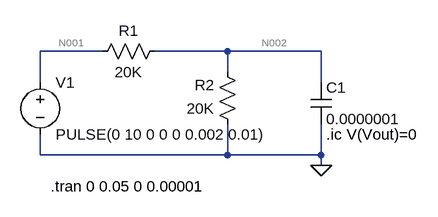
[diagram p0: schematic ELEN 115 Lab 2 Part 2.asc]
ELEN 115 Lab 2 Part 2.asc, the LTspice schematic file:
Version 4
SHEET 1 880 680
WIRE 48 112 -48 112
WIRE 240 112 128 112
WIRE 384 112 240 112
WIRE 240 144 240 112
WIRE -48 160 -48 112
WIRE 384 160 384 112
WIRE -48 272 -48 240
WIRE 240 272 240 224
WIRE 240 272 -48 272
WIRE 384 272 384 224
WIRE 384 272 240 272
WIRE 384 288 384 272
FLAG 384 288 0
SYMBOL res 144 96 R90
WINDOW 0 0 56 VBottom 2
WINDOW 3 32 56 VTop 2
SYMATTR InstName R1
SYMATTR Value 20K
SYMBOL res 256 240 R180
WINDOW 0 36 76 Left 2
WINDOW 3 36 40 Left 2
SYMATTR InstName R2
SYMATTR Value 20K
SYMBOL cap 368 160 R0
SYMATTR InstName C1
SYMATTR Value 0.0000001
SYMBOL voltage -48 144 R0
WINDOW 123 0 0 Left 0
WINDOW 39 0 0 Left 0
SYMATTR InstName V1
SYMATTR Value PULSE(0 10 0 0 0 0.002 0.01)
TEXT 392 240 Left 2 !.ic V(Vout)=0
TEXT -32 320 Left 2 !.tran 0 0.05 0 0.00001

The netlist it stands for:
* ELEN 115 Lab 2 Part 2.asc
R1 N002 N001 20K
R2 0 N002 20K
C1 N002 0 0.0000001
V1 N001 0 PULSE(0 10 0 0 0 0.002 0.01)
.ic V(Vout)=0
.tran 0 0.05 0 0.00001
.backanno
.end

* Results of the author's LTspice run, read from the files saved beside the schematic
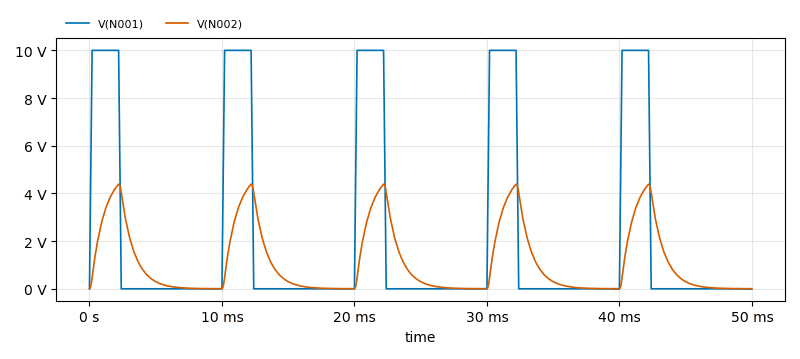
[diagram p1: Transient Analysis of ELEN 115 Lab 2 Part 2.asc, plotted from the saved traces]
* Transient Analysis, 1 run:
*   V(N001): min 0 V, max 10 V, average 2.2 V, rms 4.621 V, last 0 V
*   V(N002): min 0 V, max 4.394 V, average 1.101 V, rms 1.815 V, last 2.017 mV